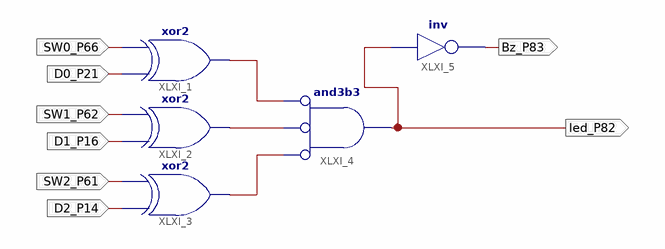
[diagram p0: schematic sheet 1]
// Xilinx ISE schematic Lab5_1.sch (spartan6) as structural Verilog: 5 symbols, 8 ports
module Lab5_1 (
  input  SW0_P66,
  input  D0_P21,
  input  SW1_P62,
  input  D1_P16,
  input  SW2_P61,
  input  D2_P14,
  output led_P82,
  output Bz_P83
);

  wire XLXN_3, XLXN_4, XLXN_5;

  xor XLXI_1 (XLXN_3, D0_P21, SW0_P66);
  xor XLXI_2 (XLXN_4, D1_P16, SW1_P62);
  xor XLXI_3 (XLXN_5, D2_P14, SW2_P61);
  and XLXI_4 (led_P82, ~XLXN_5, ~XLXN_4, ~XLXN_3);  // and3b3
  not XLXI_5 (Bz_P83, led_P82);
endmodule
